# EAGLE design respirhoCR2450 (EAGLE 9.6.2)
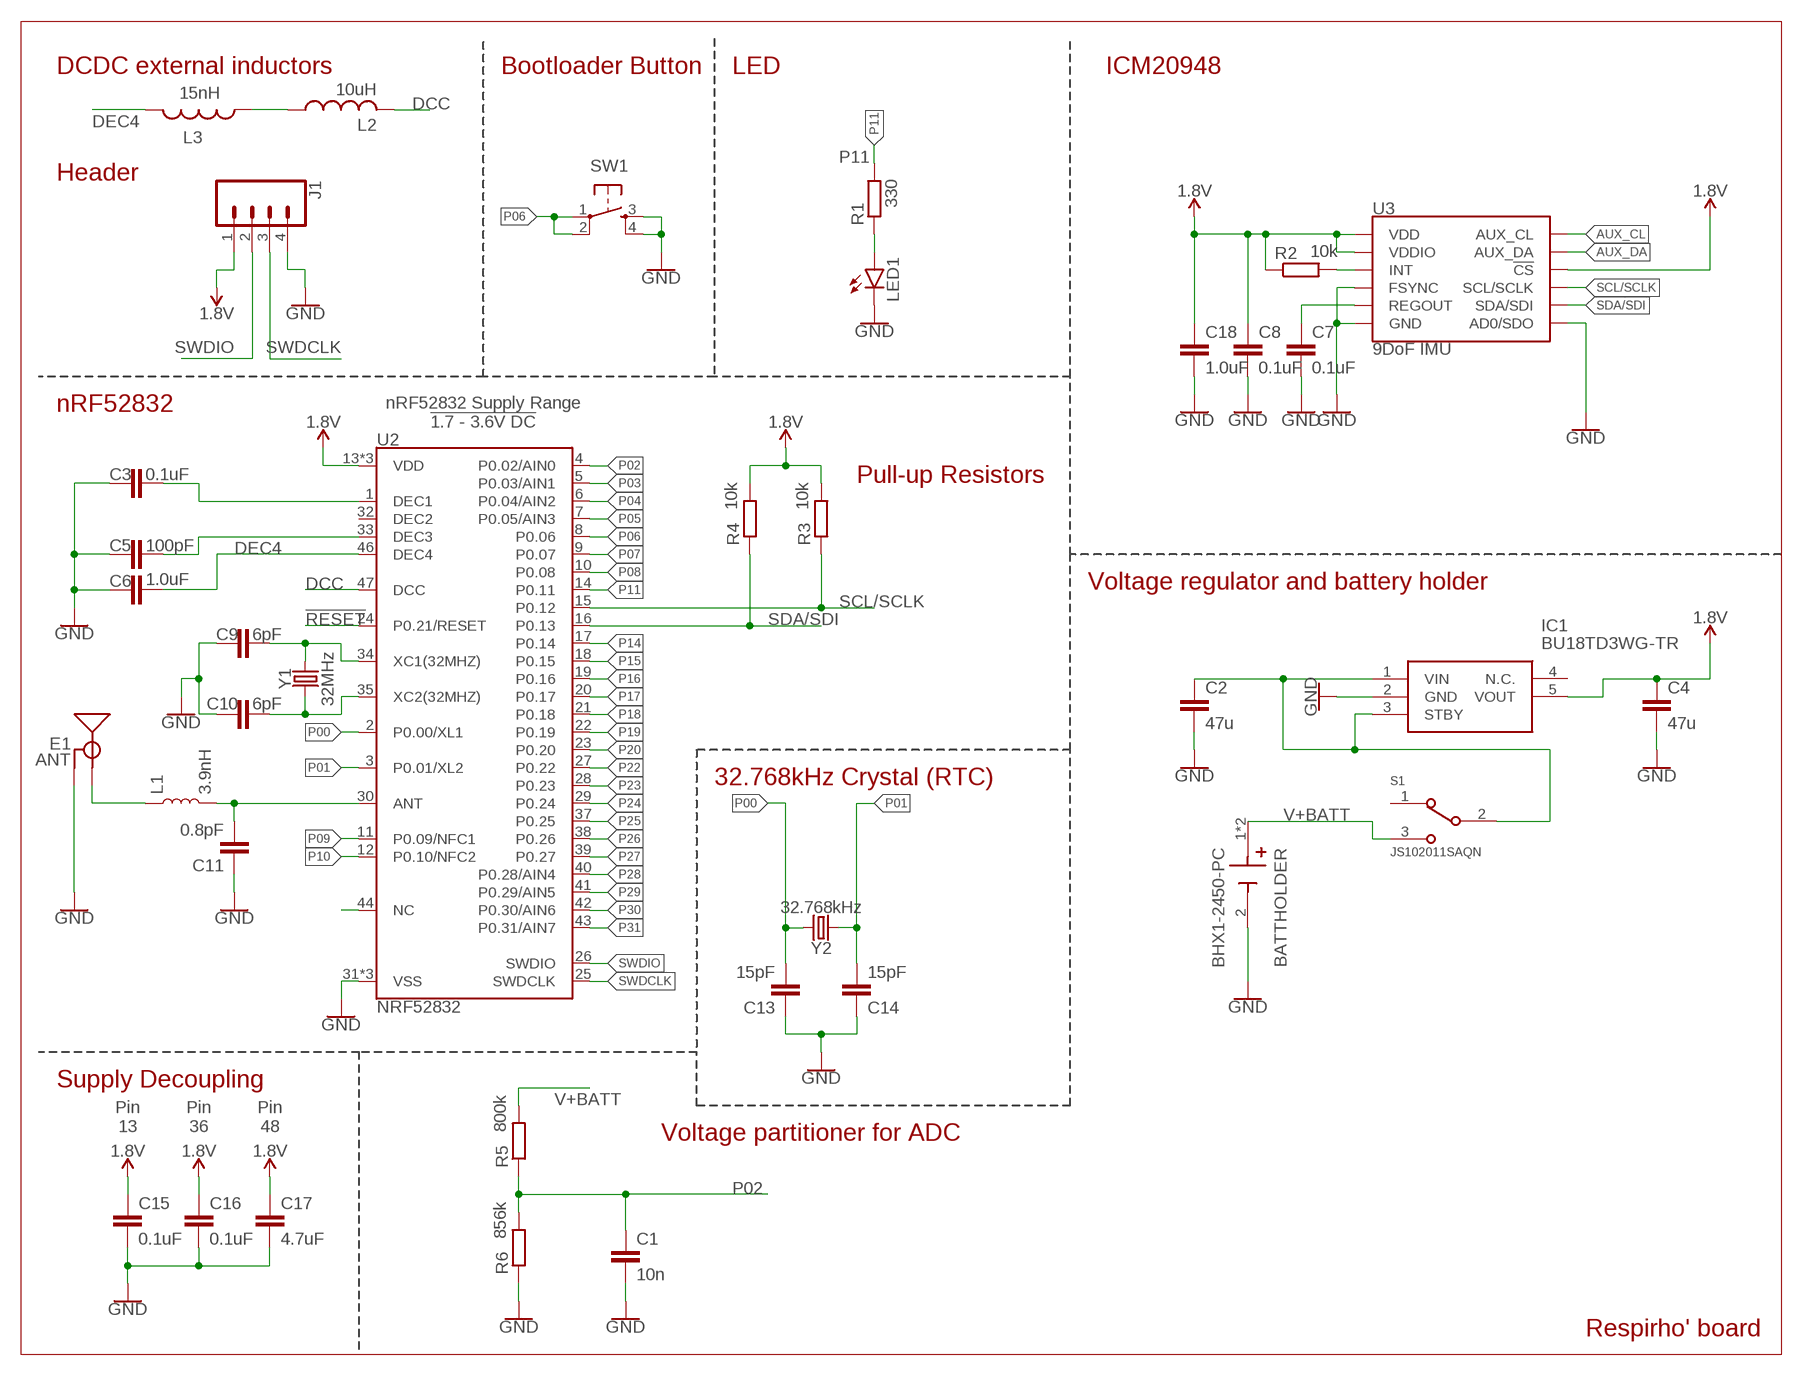
[diagram p0: schematic, sheet 1]

## Parts
BATTHOLDER  BHX1-2450-PC  [BAT_BHX1-2450-PC]
C1  10n  C-EUC1206  [C1206]
C2  47u  C-EUC1206  [C1206]
C3  0.1uF  0.1UF-0402-16V-10%  [0402]
C4  47u  C-EUC1206  [C1206]
C5  100pF  100PF-0402-50V-5%  [0402]
C6  1.0uF  1.0UF-0402-16V-10%  [0402]
C7  0.1uF  0.1UF-0603-25V-5%  [0603]
C8  0.1uF  0.1UF-0603-25V-5%  [0603]
C9  6pF  6PF-0402-50V-0.5%  [0402]
C10  6pF  6PF-0402-50V-0.5%  [0402]
C11  0.8pF  0.8PF-0402-50V-0.1PF  [0402]
C13  15pF  15PF-0402-50V-5%  [0402]
C14  15pF  15PF-0402-50V-5%  [0402]
C15  0.1uF  0.1UF-0402-16V-10%  [0402]
C16  0.1uF  0.1UF-0402-16V-10%  [0402]
C17  4.7uF  4.7UF0603  [0603]
C18  1.0uF  1.0UF-0603-16V-10%-X7R  [0603]
E1  ANT  ANTENNA-GROUNDEDTRACE-15.2MM  [TRACE_ANTENNA_2.4GHZ_15.2MM]
IC1  BU18TD3WG-TR  [SOT95P280X125-5N]
J1  CONN_04PTH  [1X04]
L1  3.9nH  INDUCTOR-0402-3.9NH  [0402]
L2  10uH  INDUCTOR_0603_L  [RESC0603_L]
L3  15nH  LQG15HS15NJ02D  [INDC1005X55N]
LED1  LEDCHIPLED_1206  [CHIPLED_1206]
R1  330  R-EU_R0805  [R0805]
R2  10k  R-EU_R0805  [R0805]
R3  10k  R-EU_R0805  [R0805]
R4  10k  R-EU_R0805  [R0805]
R5  800k  R-EU_R0805  [R0805]
R6  856k  R-EU_R0805  [R0805]
S1  JS102011SAQN  [SW_JS102011SAQN]
SW1  SWITCH_SPST_4_PINRECT  [TACTILE_SWITCH_SMD_4.6X2.8MM]
U2  NRF52832  [QFN48-6X6MM]
U3  9DoF IMU  ICM-20948  [QFN24-3X3]
Y1  32MHz  CRYSTAL-32MHZ-SMD-2.0X1.6MM  [CRYSTAL-SMD-2.0X1.6MM]
Y2  32.768kHz  CRYSTAL-32.768KHZSMD-3.2X1.5  [CRYSTAL-SMD-3.2X1.5MM]

## Nets
1.8V: C4.1 C8.1 C15.1 C16.1 C17.1 C18.1 IC1.5(VOUT) J1.1 R2.1 R3.2 R4.2 U2.13(VDD) U2.36(VDD) U2.48(VDD) U3.8(VDDIO) U3.13(VDD) U3.22(!CS)
!RESET!: U2.24(P0.21/RESET)
ANT: C11.2 L1.2 U2.30(ANT)
AUX_CL: U3.7(AUX_CL)
AUX_DA: U3.21(AUX_DA)
DCC: L2.2 U2.47(DCC)
DEC1: C3.2 U2.1(DEC1)
DEC3: C5.2 U2.33(DEC3)
DEC4: C6.2 L3.2 U2.46(DEC4)
GND: BATTHOLDER.2(-) C1.2 C2.2 C3.1 C4.2 C5.1 C6.1 C7.2 C8.2 C9.1 C10.2 C11.1 C13.1 C14.1 C15.2 C16.2 C17.2 C18.2 E1.GND IC1.2(GND) J1.4 LED1.C R6.1 SW1.3 SW1.4 U2.31(VSS) U2.45(VSS) U2.EP(VSS) U3.9(AD0/SDO) U3.11(FSYNC) U3.18(GND) U3.20(GND)
N$1: LED1.A R1.1
N$2: C7.1 U3.10(REGOUT)
N$3: R2.2 U3.12(INT)
N$4: C2.1 IC1.1(VIN) IC1.3(STBY) S1.2
N$5: L2.1 L3.1
N$11: E1.ANT(SIGNAL) L1.1
NC: U2.44(NC)
P00: C13.2 U2.2(P0.00/XL1) Y2.P$2
P01: C14.2 U2.3(P0.01/XL2) Y2.P$1
P02: C1.1 R5.1 R6.2 U2.4(P0.02/AIN0)
P03: U2.5(P0.03/AIN1)
P04: U2.6(P0.04/AIN2)
P05: U2.7(P0.05/AIN3)
P06: SW1.1 SW1.2 U2.8(P0.06)
P07: U2.9(P0.07)
P08: U2.10(P0.08)
P09: U2.11(P0.09/NFC1)
P10: U2.12(P0.10/NFC2)
P11: R1.2 U2.14(P0.11)
P14: U2.17(P0.14)
P15: U2.18(P0.15)
P16: U2.19(P0.16)
P17: U2.20(P0.17)
P18: U2.21(P0.18)
P19: U2.22(P0.19)
P20: U2.23(P0.20)
P22: U2.27(P0.22)
P23: U2.28(P0.23)
P24: U2.29(P0.24)
P25: U2.37(P0.25)
P26: U2.38(P0.26)
P27: U2.39(P0.27)
P28: U2.40(P0.28/AIN4)
P29: U2.41(P0.29/AIN5)
P30: U2.42(P0.30/AIN6)
P31: U2.43(P0.31/AIN7)
SCL/SCLK: R3.1 U2.15(P0.12) U3.23(SCL/SCLK)
SDA/SDI: R4.1 U2.16(P0.13) U3.24(SDA/SDI)
SWDCLK: J1.3 U2.25(SWDCLK)
SWDIO: J1.2 U2.26(SWDIO)
V+BATT: BATTHOLDER.1(+) BATTHOLDER.1_1(+) R5.2 S1.3
XC1: C9.2 U2.34(XC1(32MHZ)) Y1.3
XC2: C10.1 U2.35(XC2(32MHZ)) Y1.1
Unconnected: IC1.4(N.C.) S1.1 U2.32(DEC2)

## Notes on the sheet
- DCDC external inductors | Bootloader Button | LED | ICM20948
- Header
- nRF52832
- nRF52832 Supply Range
  !1.7 - 3.6V DC!
- Pull-up Resistors
- Voltage regulator and battery holder
- 32.768kHz Crystal (RTC)
- Supply Decoupling
- Pin
  13
- Pin
  36
- Pin
  48
- Voltage partitioner for ADC
- Respirho' board

## Library data of the parts
BATTHOLDER = CR2450TH:BHX1-2450-PC: CR2450 PC pins battery retainer with insulator; DESCRIPTION: Battery Retainer Coin, 24.5mm 1 Cell PC Pin; DIGI-KEY_PART_NUMBER: BHX1-2450-PC-ND; MF: MPD; MP: BHX1-2450-PC; PACKAGE: None
C1 C2 C4 = rcl:C-EU: CAPACITOR, European symbol; SPICEPREFIX: C
C3 C15 C16 = SparkFun-Capacitors:0.1UF: 0.1µF ceramic capacitors A capacitor is a passive two-terminal electrical component used to store electrical energy temporarily in an electric field.; PROD_ID: CAP-12416
C5 = nrf52832-breakout-temp:100PF: 100pF/0.1nF ceramic capacitors A capacitor is a passive two-terminal electrical component used to store electrical energy temporarily in an electric field.; PROD_ID: CAP-13458
C6 = SparkFun-Capacitors:1.0UF: 1µF ceramic capacitors A capacitor is a passive two-terminal electrical component used to store electrical energy temporarily in an electric field.; PROD_ID: CAP-12417
C7 C8 = SparkFun-Capacitors:0.1UF: 0.1µF ceramic capacitors A capacitor is a passive two-terminal electrical component used to store electrical energy temporarily in an electric field.; PROD_ID: CAP-08604
C9 C10 = nrf52832-breakout-temp:6PF: 15pF ceramic capacitors A capacitor is a passive two-terminal electrical component used to store electrical energy temporarily in an electric field.; PROD_ID: CAP-13455
C11 = nrf52832-breakout-temp:0.8PF: 0.8pF ceramic capacitors A capacitor is a passive two-terminal electrical component used to store electrical energy temporarily in an electric field.; PROD_ID: CAP-13456
C13 C14 = SparkFun-Capacitors:15PF: 15pF ceramic capacitors A capacitor is a passive two-terminal electrical component used to store electrical energy temporarily in an electric field.; PROD_ID: CAP-13063
C17 = SparkFun-Capacitors:4.7UF: 4.7µF ceramic capacitors A capacitor is a passive two-terminal electrical component used to store electrical energy temporarily in an electric field.; PROD_ID: CAP-08280
C18 = SparkFun-Capacitors:1.0UF: 1µF ceramic capacitors A capacitor is a passive two-terminal electrical component used to store electrical energy temporarily in an electric field.; PROD_ID: CAP-13930
E1 = SparkFun-RF:ANTENNA-GROUNDED: Antenna w/ Ground Connection 2.4GHz antennae with signal and ground terminals. TRACE_ANTENNA_2.4GHZ_15.2MM - Meander Trace antenna 15.2 x 5.7mm footprint Based on layout from TI app note AN043 <http://www.ti.com/lit/an/swra117d/swra117d.pdf>. TRACE_ANTENNA_2.4GHZ_25.7MM - Inverted F trace antenna 25.7 x 7.5 mm footprint. Based on layout from TI design note DN0007 <http://www.ti.com/lit/an/swru120b/swru120b.pdf>.
IC1 = SamacSys_Parts:BU18TD3WG-TR: 1ch 200mA CMOS LDO Regulators: The BU**TD2WNVX / BU**TD3WG series integrates a 200mA output high performance FULL CMOS regulator into an ultra-compact SSON004X1010 package (1.0mm1.0mm0.6mm) & SSOP5 package(2.9mm2.8mm1.15mm). Additional features include a circuit current of only 35A for low power consumption along with superior noise and load response characteristics, making them ideal for use in power supplies for a wide variety of applications, including logic ICs, RF circuits, and camera modules. Source: Datasheet <https://www.rohm.com/datasheet/BU18TD3WG/buxxtd3wg-e>; DESCRIPTION: 1ch 200mA CMOS LDO Regulators: The BU**TD2WNVX / BU**TD3WG series integrates a 200mA output high performance FULL CMOS regulator into an ultra-compact SSON004X1010 package (1.0mm1.0mm0.6mm) & SSOP5 package(2.9mm2.8mm1.15mm). Additional features include a circuit current of only 35A for low power consumption along with superior noise and load response characteristics, making them ideal for use in power supplies for a wide variety of applications, including logic ICs, RF circuits, and camera modules.; HEIGHT: 1.25mm; MANUFACTURER_NAME: ROHM Semiconductor; MANUFACTURER_PART_NUMBER: BU18TD3WG-TR; MOUSER_PART_NUMBER: 755-BU18TD3WG-TR; MOUSER_PRICE-STOCK: https://www.mouser.co.uk/ProductDetail/ROHM-Semiconductor/BU18TD3WG-TR/?qs=IsRgwgmxh6%252BpD8NB5Z8kfQ%3D%3D
J1 = SparkFun-Connectors:CONN_04: Multi connection point. Often used as Generic Header-pin footprint for 0.1 inch spaced/style header connections On any of the 0.1 inch spaced packages, you can populate with these: Break Away Headers - Straight <https://www.sparkfun.com/products/116> (PRT-00116) Break Away Male Headers - Right Angle <https://www.sparkfun.com/products/553> (PRT-00553) Female Headers <https://www.sparkfun.com/products/115> (PRT-00115) Break Away Headers - Machine Pin <https://www.sparkfun.com/products/117> (PRT-00117) Break Away Female Headers - Swiss Machine Pin <https://www.sparkfun.com/products/743> (PRT-00743) For SCREWTERMINALS and SPRING TERMINALS visit here: Screw Terimnals on SparkFun.com <https://www.sparkfun.com/search/results?term=Screw+Terminals> (5mm/3.5mm/2.54mm spacing) This device is also useful as a general connection point to wire up your design to another part of your project. Our various solder wires solder well into these plated through hole pads. Hook-Up Wire - Assortment (Stranded, 22 AWG) <https://www.sparkfun.com/products/11375> (PRT-11375) Hook-Up Wire - Assortment (Solid Core, 22 AWG) <https://www.sparkfun.com/products/11367> (PRT-11367) View the entire wire category on our website here <https://www.sparkfun.com/categories/141> Special notes: Molex polarized connector foot print use with SKU : PRT-08231 with associated crimp pins and housings. 1MM SMD Version SKU: PRT-10208; PROD_ID: CONN-09696
L1 = nrf52832-breakout-temp:INDUCTOR: Inductors Resist changes in electrical current. Basically a coil of wire. SparkFun Products: SparkFun Load Cell Amplifier - HX711 <https://www.sparkfun.com/products/13879> IOIO-OTG - V2.2 <https://www.sparkfun.com/products/13613>; PROD_ID: NDUC-13457
L2 = Nordic_nRF:INDUCTOR: Generic chip inductor
L3 = LQG15HS15NJ02D:LQG15HS15NJ02D: Ind RF Chip Multi-Layer 15nH 5% 100MHz 8Q-Factor Air 300mA 0402 Paper T/R; DESCRIPTION: Inductor with Inductance: 15nH Tol. +/-5%, Package: 0402 _1005_; DIGI-KEY_PART_NUMBER: 490-2625-1-ND; DIGI-KEY_PURCHASE_URL: https://www.digikey.com/product-detail/en/murata-electronics/LQG15HS15NJ02D/490-2625-1-ND/662905?utm_source=snapeda&utm_medium=aggregator&utm_campaign=symbol; MF: Murata Electronics; MP: LQG15HS15NJ02D; PACKAGE: 1005 Murata
LED1 = led:LED: LED OSRAM: - CHIPLED LG R971, LG N971, LY N971, LG Q971, LY Q971, LO R971, LY R971 LH N974, LH R974 LS Q976, LO Q976, LY Q976 LO Q996 - Hyper CHIPLED LW Q18S LB Q993, LB Q99A, LB R99A - SideLED LS A670, LO A670, LY A670, LG A670, LP A670 LB A673, LV A673, LT A673, LW A673 LH A674 LY A675 LS A676, LA A676, LO A676, LY A676, LW A676 LS A679, LY A679, LG A679 - Hyper Micro SIDELED® LS Y876, LA Y876, LO Y876, LY Y876 LT Y87S - SmartLED LW L88C, LW L88S LB L89C, LB L89S, LG L890 LS L89K, LO L89K, LY L89K LS L896, LA L896, LO L896, LY L896 - TOPLED LS T670, LO T670, LY T670, LG T670, LP T670 LSG T670, LSP T670, LSY T670, LOP T670, LYG T670 LG T671, LOG T671, LSG T671 LB T673, LV T673, LT T673, LW T673 LH T674 LS T676, LA T676, LO T676, LY T676, LB T676, LH T676, LSB T676, LW T676 LB T67C, LV T67C, LT T67C, LS T67K, LO T67K, LY T67K, LW E67C LS E67B, LA E67B, LO E67B, LY E67B, LB E67C, LV E67C, LT E67C LW T67C LS T679, LY T679, LG T679 LS T770, LO T770, LY T770, LG T770, LP T770 LB T773, LV T773, LT T773, LW T773 LH T774 LS E675, LA E675, LY E675, LS T675 LS T776, LA T776, LO T776, LY T776, LB T776 LHGB T686 LT T68C, LB T68C - Hyper Mini TOPLED® LB M676 - Mini TOPLED Santana® LG M470 LS M47K, LO M47K, LY M47K Source: http://www.osram.convergy.de LUXEON: - LUMILED® LXK2-PW12-R00, LXK2-PW12-S00, LXK2-PW14-U00, LXK2-PW14-V00 LXK2-PM12-R00, LXK2-PM12-S00, LXK2-PM14-U00 LXK2-PE12-Q00, LXK2-PE12-R00, LXK2-PE12-S00, LXK2-PE14-T00, LXK2-PE14-U00 LXK2-PB12-K00, LXK2-PB12-L00, LXK2-PB12-M00, LXK2-PB14-N00, LXK2-PB14-P00, LXK2-PB14-Q00 LXK2-PR12-L00, LXK2-PR12-M00, LXK2-PR14-Q00, LXK2-PR14-R00 LXK2-PD12-Q00, LXK2-PD12-R00, LXK2-PD12-S00 LXK2-PH12-R00, LXK2-PH12-S00 LXK2-PL12-P00, LXK2-PL12-Q00, LXK2-PL12-R00 Source: www.luxeon.com KINGBRIGHT: KA-3528ASYC Source: www.kingbright.com
R1-R6 = rcl:R-EU_: RESISTOR, European symbol; SPICEPREFIX: R
S1 = JS102011SAQN:JS102011SAQN: JS10 Series SPDT On-On 6 V 0.3 A Gull Wing SMT Slide Switch http://www.snapeda.com/parts/JS102011SAQN/C%26K%20Components/view-part/; DESCRIPTION: Slide Switch SPDT Surface Mount, Right Angle; DIGI-KEY_PART_NUMBER: 401-1999-1-ND; MF: C&K; MP: JS102011SAQN; PACKAGE: None; PURCHASE-URL: https://pricing.snapeda.com/search/part/JS102011SAQN/?ref=eda
SW1 = SparkFun-Electromechanical:SWITCH_SPST_4_PIN; PROD_ID: SWCH-13065
U2 = nrf52832-breakout-temp:NRF52832: Nordic nRF52832 Bluetooth Smart/ANT/2.4GHz RF SoC The nRF52832 SoC is a powerful, highly flexible ultra-low power multiprotocol SoC ideally suited for Bluetooth® Smart ANT and 2.4GHz ultra low-power wireless applications. The nRF52832 SoC is built around a 32-bit ARM® Cortex™-M4F CPU with 512kB + 64kB RAM. The embedded 2.4GHz transceiver supports Bluetooth Smart, ANT and proprietary 2.4 GHz protocol stack. It is on air compatible with the nRF51 Series, nRF24L and nRF24AP Series products from Nordic Semiconductor. Product Page <https://www.nordicsemi.com/eng/Products/Bluetooth-low-energy2/nRF52832>; PROD_ID: IC-13460
U3 = SparkFun-Sensors:ICM-20948: ICM-20948 9 Degree of Freedom IMU World’s lowest power 9-axis MotionTracking device that is ideally suited for smartphones, tablets, wearable sensors, and IoT applications. Includes onboard Digital Motion Processor to offload computations from the host processor Datasheet <https://cdn.sparkfun.com/assets/learn_tutorials/5/5/0/MPU9250REV1.0.pdf> SparkFun Products: SparkFun IMU Breakout - ICM-20948 <https://www.sparkfun.com/products/15182>; PROD_ID: IC-14247
Y1 = nrf52832-breakout-temp:CRYSTAL-32MHZ: 32MHz Crystal Digikey Example <http://www.digikey.com/product-detail/en/murata-electronics-north-america/XRCGB32M000F2P00R0/490-9769-1-ND/4952013> Frequency: 32MHz Frequency Stability: ±20ppm Frequency Tolerance: ±20ppm Load Capacitance: 6pF; PROD_ID: XTAL-13459
Y2 = SparkFun-Clocks:CRYSTAL-32.768KHZ: 32.768kHz Crystal Frequency: 32.768kHz Frequency Stability: ±20ppm Load Capacitance: 12.5pF (PTH-2X6 & SMD-3.2X1.5), 6pF (SMD-2X6); PROD_ID: XTAL-13062

## Board
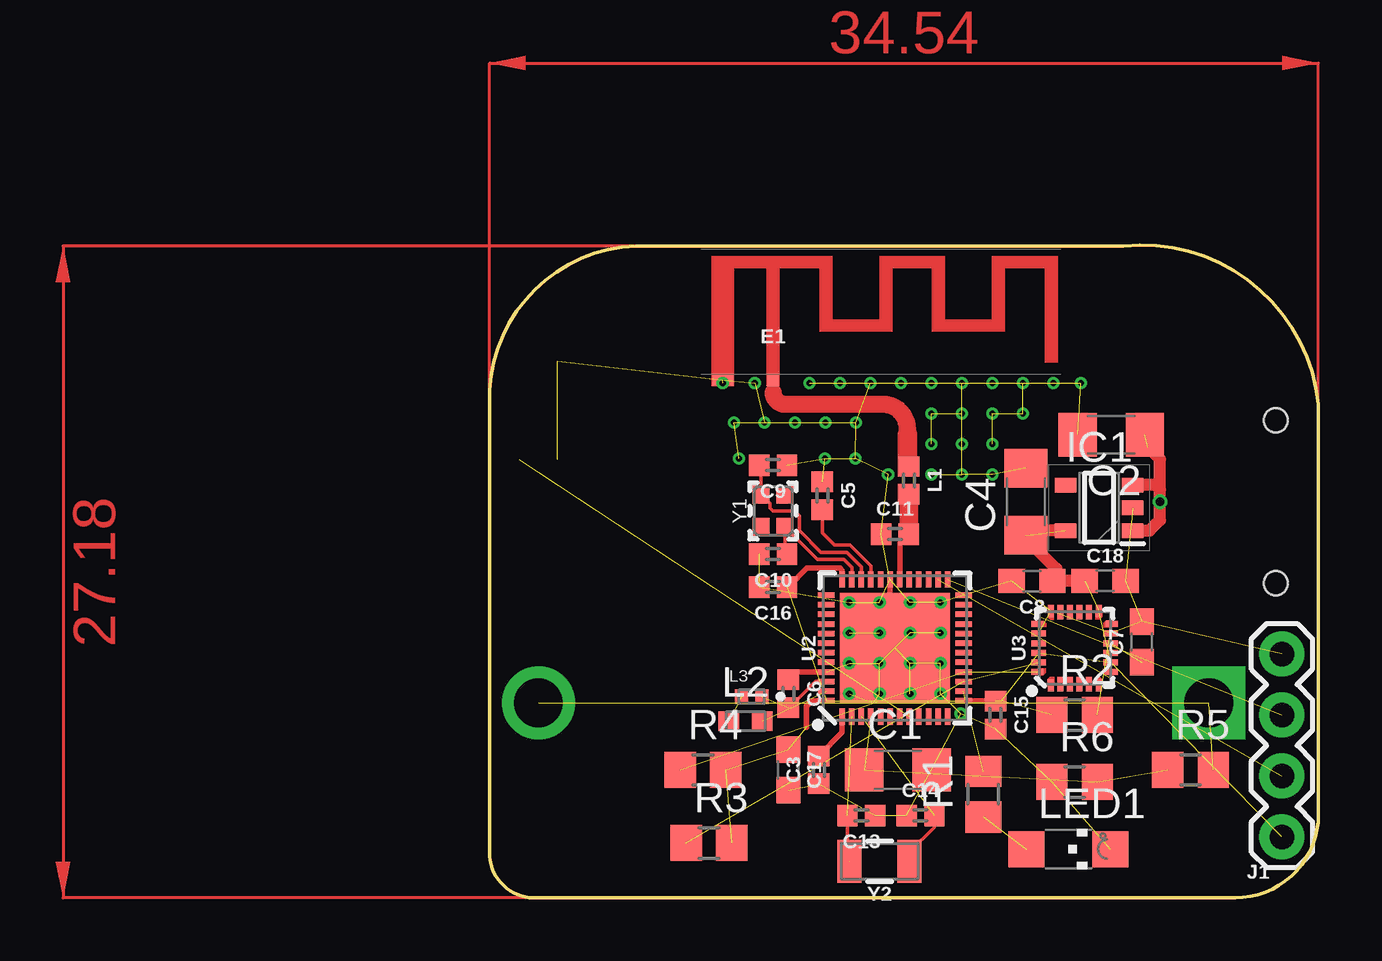
[diagram p1: board, top side]
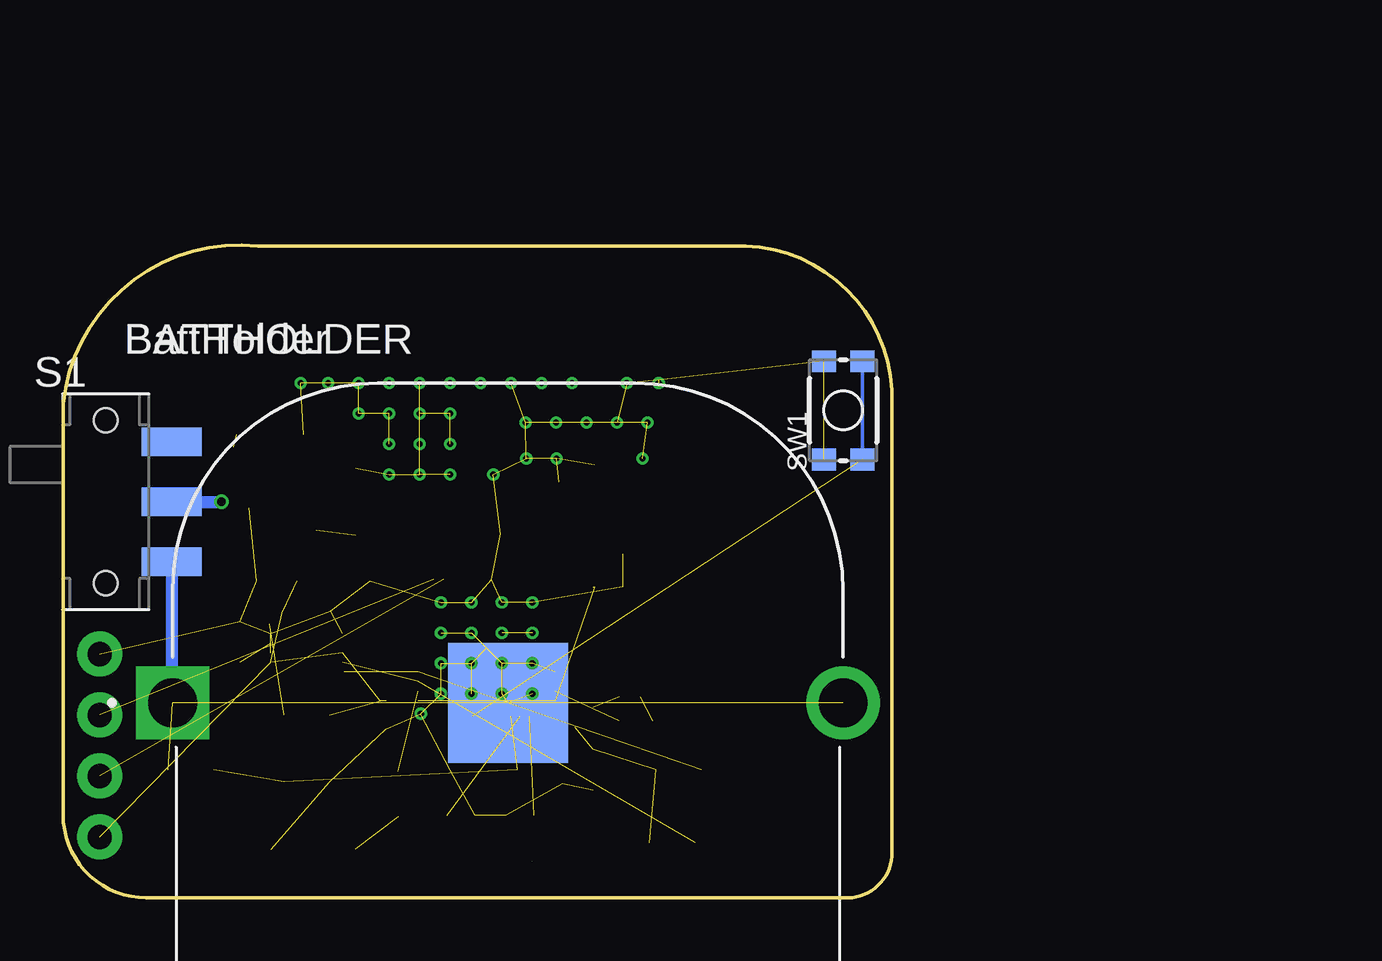
[diagram p2: board, bottom side, seen from below]

Size 34.54 x 27.22 mm. Coordinates in mm from the lower left corner, seen from the top.
Outline: 0,20.58 0,1.74 arc90 1.99,0 31.07,0 arc90 34.54,3.47 34.54,20.58 arc90 26.42,27.18 6.1,27.18 arc90 0,20.58
Copper layers (1*16): Top 0.035mm / dielectric 1.5mm / Bottom 0.035mm
Design rules "SparkFun-2-layer-FAB-LIMIT *": minimum track width 4mil, minimum drill 6mil, track to track 6mil, track to pad 6mil, pad to pad 6mil, via to via 6mil, smd to smd 6mil, copper to edge 4mil, drill to drill 4mil, minimum pad ring 5mil, minimum via ring 5mil, stop-mask expansion 4mil, vias tented up to drill 25mil, thermal gap 10mil
tRestrict: 2 lines

### Footprints (pad centres in the part's own frame; a part is rotated, then mirrored left to right if it is on the bottom)
BAT_BHX1-2450-PC = drill 2.03 pad 3.05 square: 1 -13.97,0 | drill 2.03 pad 3.05: 1_1 13.97,0 | smd 5 x 5: 2 0,0
C1206 = smd 1.6 x 1.8: 1 -1.4,0; 2 1.4,0
0402 = smd 0.85 x 0.9: 1 -0.58,0; 2 0.58,0
0603 = smd 1.1 x 1: 1 -0.85,0; 2 0.85,0
TRACE_ANTENNA_2.4GHZ_15.2MM = smd 0.5 x 0.5: ANT 0,-0.25 | smd 0.9 x 0.5: GND -2.1,-0.25
SOT95P280X125-5N = smd 0.9 x 0.6: 1 -1.4,0.95; 2 -1.4,0; 3 -1.4,-0.95; 4 1.4,-0.95; 5 1.4,0.95
1X04 = drill 1.016 pad 1.88: 1 0,0; 2 2.54,0; 3 5.08,0; 4 7.62,0
RESC0603_L = smd 0.85 x 0.8: 1 -0.7,0; 2 0.7,0
INDC1005X55N = smd 0.54 x 0.6: 1 -0.432,0; 2 0.432,0
CHIPLED_1206 = smd 1.5 x 1.5: A 0,-1.75; C 0,1.75
R0805 = smd 1.3 x 1.5: 1 -0.95,0; 2 0.95,0
SW_JS102011SAQN = smd 1.2 x 2.5: 1 -2.5,2.75; 2 0,2.75; 3 2.5,2.75 | hole 1: -3.4,0; 3.4,0
TACTILE_SWITCH_SMD_4.6X2.8MM = smd 0.9 x 1: 1 -2.05,-0.8; 2 2.05,-0.8; 3 2.05,0.8; 4 -2.05,0.8
QFN48-6X6MM = smd 0.68 x 0.23: 1 -2.86,2.2; 2 -2.86,1.8; 3 -2.86,1.4; 4 -2.86,1; 5 -2.86,0.6; 6 -2.86,0.2; 7 -2.86,-0.2; 8 -2.86,-0.6; 9 -2.86,-1; 10 -2.86,-1.4; 11 -2.86,-1.8; 12 -2.86,-2.2; 25 2.86,-2.2; 26 2.86,-1.8; 27 2.86,-1.4; 28 2.86,-1; 29 2.86,-0.6; 30 2.86,-0.2; 31 2.86,0.2; 32 2.86,0.6; 33 2.86,1; 34 2.86,1.4; 35 2.86,1.8; 36 2.86,2.2 | smd 0.23 x 0.68: 13 -2.2,-2.86; 14 -1.8,-2.86; 15 -1.4,-2.86; 16 -1,-2.86; 17 -0.6,-2.86; 18 -0.2,-2.86; 19 0.2,-2.86; 20 0.6,-2.86; 21 1,-2.86; 22 1.4,-2.86; 23 1.8,-2.86; 24 2.2,-2.86; 37 2.2,2.86; 38 1.8,2.86; 39 1.4,2.86; 40 1,2.86; 41 0.6,2.86; 42 0.2,2.86; 43 -0.2,2.86; 44 -0.6,2.86; 45 -1,2.86; 46 -1.4,2.86; 47 -1.8,2.86; 48 -2.2,2.86 | smd 4.6 x 4.6: EP 0,0
QFN24-3X3 = smd 0.495 x 0.25: 1 -1.552,1; 6 -1.552,-1; 13 1.552,-1; 18 1.552,1 | smd 0.6 x 0.25: 2 -1.5,0.6; 3 -1.5,0.2; 4 -1.5,-0.2; 5 -1.5,-0.6; 14 1.5,-0.6; 15 1.5,-0.2; 16 1.5,0.2; 17 1.5,0.6 | smd 0.25 x 0.495: 7 -1,-1.552; 12 1,-1.552; 19 1,1.552; 24 -1,1.552 | smd 0.25 x 0.6: 8 -0.6,-1.5; 9 -0.2,-1.5; 10 0.2,-1.5; 11 0.6,-1.5; 20 0.6,1.5; 21 0.2,1.5; 22 -0.2,1.5; 23 -0.6,1.5
CRYSTAL-SMD-2.0X1.6MM = smd 0.75 x 0.7: 1 -0.675,-0.5; 2 0.675,-0.5; 3 0.675,0.5; 4 -0.675,0.5
CRYSTAL-SMD-3.2X1.5MM = smd 1 x 1.8: P$1 -1.25,0; P$2 1.25,0

### Placement (x,y rotation side)
BATTHOLDER  16,8.13 0 bottom
C1  17.02,5.34 0 top
C2  25.91,19.31 180 top
C3  13.72,5.34 90 top
C4  22.35,16.51 90 top
C5  13.87,16.77 270 top
C6  12.45,8.51 270 top
C7  27.18,10.67 90 top
C8  22.61,13.21 180 top
C9  11.81,18.04 180 top
C10  11.81,14.33 180 top
C11  16.89,15.17 0 top
C13  15.49,3.43 180 top
C14  17.96,3.43 0 top
C15  21.08,7.62 270 top
C16  11.81,12.96 180 top
C17  12.45,5.34 270 top
C18  25.65,13.21 0 top
E1  11.81,21.85 0 top
IC1  25.4,16.26 180 top
J1  33.02,2.54 90 top
L1  17.47,17.4 270 top
L2  10.67,7.37 0 top
L3  10.92,8.39 0 top
LED1  24.13,2.04 270 top
R1  20.57,4.32 90 top
R2  24.38,7.62 0 top
R3  9.14,2.29 0 top
R4  8.89,5.34 0 top
R5  29.21,5.34 0 top
R6  24.38,4.83 0 top
S1  32.77,16.51 270 bottom
SW1  2.03,20.32 90 bottom
U2  16.89,10.42 90 top
U3  24.38,10.42 90 top
Y1  11.81,16.13 90 top
Y2  16.26,1.53 180 top

### Tracks (layer width: path | path; a pad name or v marks a point on that pad's centre or on a via)
1.8V  (14 unrouted)
  Top 0.229: U2.36 14.69,13.66 14.61,13.74 13.23,13.74 12.45,12.96 | U2.13 21.32,8.22 | U2.48 13.42,8.22 13.21,8 13.21,7.12
  Top 0.508: IC1.5 23.05,15.31 22.86,15.5 22.35,14.99 23.62,13.72 23.62,13.38 | 23.62,13.38 C8.1 | C18.1 23.79,13.21 23.62,13.38
ANT
  Top 0.229: U2.30 17.09,14.79 C11.2
  Top 0.762: C11.2 L1.2
DCC  (1 unrouted)
DEC1
  Top 0.229: U2.1 14.69,6.89 C3.2
DEC3
  Top 0.152: U2.33 15.89,13.83 15.01,14.71 14.38,14.71 13.87,15.22 C5.2
DEC4  (1 unrouted)
  Top 0.152: C6.2 12.5,7.93 13.59,9.02 U2.46
GND  (via drill 0.25)  (76 unrouted)
  Top 0.152: 16.69,10.62 v16.26,11.05
  Top 0.229: U2.31 16.69,10.62 U2.EP | C16.2 11.18,12.96 | U2.45 12.77,9.42 C6.1
  other vias: 9.72,21.47 10.39,18.32 13.97,18.32 15.24,18.32 16.61,17.66 18.41,17.66 19.63,7.68 17.53,9.78 17.53,8.51 17.53,11.05 17.53,12.32 16.26,12.32 16.26,9.78 16.26,8.51 14.99,8.51 14.99,9.78 14.99,11.05 14.99,12.32 18.8,12.32 18.8,11.05 18.8,9.78 18.8,8.51 18.41,18.93 18.41,20.2 18.41,21.47 17.14,21.47 15.88,21.47 14.61,21.47 13.33,21.47 15.27,19.82 14,19.82 12.73,19.82 11.05,21.47 19.68,17.66 19.68,18.93 19.68,20.2 19.68,21.47 20.95,21.47 22.22,21.47 23.5,21.47 24.64,21.47 11.46,19.82 10.19,19.82 20.95,17.66 20.95,18.93 20.95,20.2 22.22,20.2
N$1  (1 unrouted)
N$2  (1 unrouted)
N$3  (1 unrouted)
N$4  (via drill 0.35)  (1 unrouted)
  Top 0.508: IC1.1 27.5,15.31 27.94,15.75 v27.94,16.51 27.94,17.02 | 27.94,17.02 27.75,17.21 IC1.3 | 27.94,17.02 27.94,18.29 27.43,18.8
  Bottom 0.508: S1.2 v27.94,16.51
N$5  (1 unrouted)
N$11
  Top 0.508: E1.ANT 11.81,21.09
  Top 0.711: 11.81,21.09 arc90 12.32,20.58 16.38,20.58 arc-90 17.41,19.55 17.41,19.31
  Top 0.813: L1.1 17.41,18.04 17.41,19.31
P00  (2 unrouted)
  Top 0.152: C13.2 14.91,1.62 Y2.P$2
P01  (1 unrouted)
  Top 0.152: C14.2 18.54,2.95 17.51,1.91 17.89,1.53 Y2.P$1
P02  (3 unrouted)
P06  (1 unrouted)
  Bottom 0.152: SW1.1 SW1.2
P11  (1 unrouted)
P29
  Top 0.152: U2.41
P31
  Top 0.152: U2.43
SCL/SCLK  (2 unrouted)
SDA/SDI  (2 unrouted)
SWDCLK  (1 unrouted)
SWDIO  (1 unrouted)
V+BATT  (2 unrouted)
  Bottom 0.508: S1.3 30.02,9.45 29.97,9.4 BATTHOLDER.1
XC1
  Top 0.152: U2.34 15.49,13.8 14.88,14.41 13.82,14.41 12.9,15.32 12.9,15.93 12.7,16.13 11.81,16.13 11.68,16.26 11.68,16.43 Y1.3 11.31,17.96 C9.2
XC2
  Top 0.152: U2.35 15.09,13.77 14.76,14.1 13.67,14.1 Y1.1 12.31,14.33 C10.1
(copper drawn outside any net)
  shapes: Top area x2

### Text on the board
Measures: Units in inches